# Altium schematic sheet CamLink.SchDoc
size B; SheetNumber: 1; SheetTotal: 4
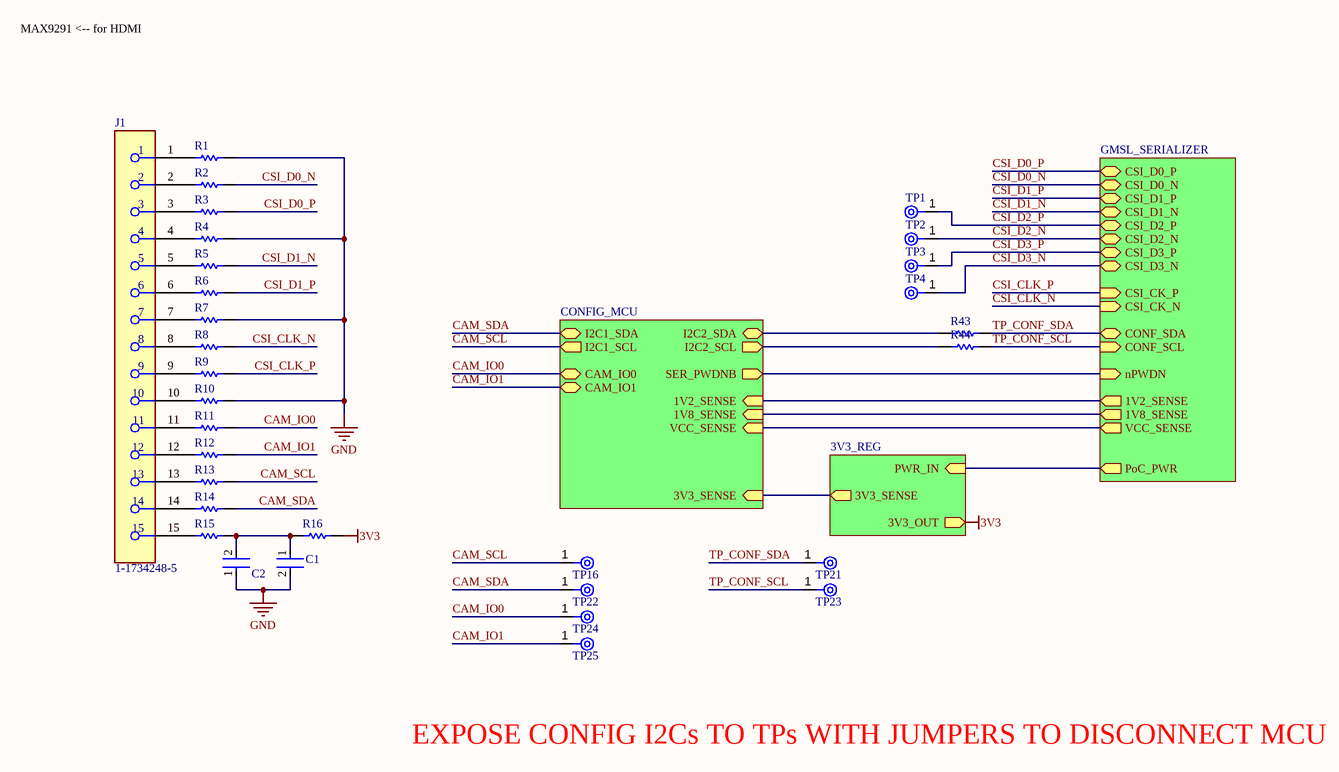
[diagram p0: CamLink.SchDoc]

## Parts
C1  CL05A106MP5NUNC  [FP-CL05A106MP5NUNC-MFG]  (value not drawn)
C2  C1005X7R1H104K050BB  [FP-C1005-050-0_05-IPC_C]  (value not drawn)
J1  1-1734248-5  [FP-1-1734248-5-MFG]
R1  RC0402JR-070RL  [RESC1005X40X25NL05T10]  (value not drawn)
R2  RC0402JR-070RL  [RESC1005X40X25NL05T10]  (value not drawn)
R3  RC0402JR-070RL  [RESC1005X40X25NL05T10]  (value not drawn)
R4  RC0402JR-070RL  [RESC1005X40X25NL05T10]  (value not drawn)
R5  RC0402JR-070RL  [RESC1005X40X25NL05T10]  (value not drawn)
R6  RC0402JR-070RL  [RESC1005X40X25NL05T10]  (value not drawn)
R7  RC0402JR-070RL  [RESC1005X40X25NL05T10]  (value not drawn)
R8  RC0402JR-070RL  [RESC1005X40X25NL05T10]  (value not drawn)
R9  RC0402JR-070RL  [RESC1005X40X25NL05T10]  (value not drawn)
R10  RC0402JR-070RL  [RESC1005X40X25NL05T10]  (value not drawn)
R11  RC0402JR-070RL  [RESC1005X40X25NL05T10]  (value not drawn)
R12  RC0402JR-070RL  [RESC1005X40X25NL05T10]  (value not drawn)
R13  RC0402JR-070RL  [RESC1005X40X25NL05T10]  (value not drawn)
R14  RC0402JR-070RL  [RESC1005X40X25NL05T10]  (value not drawn)
R15  RC0402JR-070RL  [RESC1005X40X25NL05T10]  (value not drawn)
R16  RC0402JR-070RL  [RESC1005X40X25NL05T10]  (value not drawn)
R43  RC0402JR-070RL  [RESC1005X40X25NL05T10]  (value not drawn)
R44  RC0402JR-070RL  [RESC1005X40X25NL05T10]  (value not drawn)
TP1  TPAD6R  [New footprint 1]  (value not drawn)
TP2  TPAD6R  [New footprint 1]  (value not drawn)
TP3  TPAD6R  [New footprint 1]  (value not drawn)
TP4  TPAD6R  [New footprint 1]  (value not drawn)
TP16  TPAD6R  [New footprint 1]  (value not drawn)
TP21  TPAD6R  [New footprint 1]  (value not drawn)
TP22  TPAD6R  [New footprint 1]  (value not drawn)
TP23  TPAD6R  [New footprint 1]  (value not drawn)
TP24  TPAD6R  [New footprint 1]  (value not drawn)
TP25  TPAD6R  [New footprint 1]  (value not drawn)

## Sub-sheets
ADJ_REG = 3V3_REG: PWR_IN (in), 3V3_OUT (out), 3V3_SENSE (out)
CAM_IF = GMSL_SERIALIZER: CSI_D0_P (bidir), CSI_D0_N (bidir), CSI_D1_P (bidir), CSI_D1_N (bidir), CSI_D2_P (bidir), CSI_D2_N (bidir), CSI_D3_P (bidir), CSI_D3_N (bidir), CSI_CK_P (in), CSI_CK_N (in), CONF_SDA (bidir), CONF_SCL (in), nPWDN (in), PoC_PWR (out), 1V2_SENSE (out), 1V8_SENSE (out), VCC_SENSE (out)
CONFIG_MCU = CONFIG_MCU: I2C2_SDA (bidir), I2C2_SCL (out), I2C1_SDA (bidir), I2C1_SCL (out), CAM_IO0 (bidir), CAM_IO1 (bidir), SER_PWDNB (out), 3V3_SENSE (in), 1V8_SENSE (in), 1V2_SENSE (in), VCC_SENSE (in)

## Nets
3V3: R16.2 ; sheet ADJ_REG/3V3_OUT
GND: C1.2 C2.1 R1.2 R4.2 R7.2 R10.2
CAM_IO0: R11.2 TP24.1(TP) ; sheet CONFIG_MCU/CAM_IO0
CAM_IO1: R12.2 TP25.1(TP) ; sheet CONFIG_MCU/CAM_IO1
CAM_SCL: R13.2 TP16.1(TP) ; sheet CONFIG_MCU/I2C1_SCL
CAM_SDA: R14.2 TP22.1(TP) ; sheet CONFIG_MCU/I2C1_SDA
CSI_CLK_N: R8.2 ; sheet CAM_IF/CSI_CK_N
CSI_CLK_P: R9.2 ; sheet CAM_IF/CSI_CK_P
CSI_D0_N: R2.2 ; sheet CAM_IF/CSI_D0_N
CSI_D0_P: R3.2 ; sheet CAM_IF/CSI_D0_P
CSI_D1_N: R5.2 ; sheet CAM_IF/CSI_D1_N
CSI_D1_P: R6.2 ; sheet CAM_IF/CSI_D1_P
CSI_D2_N: TP2.1(TP) ; sheet CAM_IF/CSI_D2_N
CSI_D2_P: TP1.1(TP) ; sheet CAM_IF/CSI_D2_P
CSI_D3_N: TP4.1(TP) ; sheet CAM_IF/CSI_D3_N
CSI_D3_P: TP3.1(TP) ; sheet CAM_IF/CSI_D3_P
TP_CONF_SCL: R44.2 TP23.1(TP) ; sheet CAM_IF/CONF_SCL
TP_CONF_SDA: R43.2 TP21.1(TP) ; sheet CAM_IF/CONF_SDA
NetC1_1: C1.1 C2.2 R15.2 R16.1
NetJ1_1: J1.1 R1.1
NetJ1_2: J1.2 R2.1
NetJ1_3: J1.3 R3.1
NetJ1_4: J1.4 R4.1
NetJ1_5: J1.5 R5.1
NetJ1_6: J1.6 R6.1
NetJ1_7: J1.7 R7.1
NetJ1_8: J1.8 R8.1
NetJ1_9: J1.9 R9.1
NetJ1_10: J1.10 R10.1
NetJ1_11: J1.11 R11.1
NetJ1_12: J1.12 R12.1
NetJ1_13: J1.13 R13.1
NetJ1_14: J1.14 R14.1
NetJ1_15: J1.15 R15.1
NetR43_1: R43.1 ; sheet CONFIG_MCU/I2C2_SDA
NetR44_1: R44.1 ; sheet CONFIG_MCU/I2C2_SCL
(unnamed): sheet CAM_IF/nPWDN, sheet CONFIG_MCU/SER_PWDNB
(unnamed): sheet CAM_IF/PoC_PWR, sheet ADJ_REG/PWR_IN
(unnamed): sheet CAM_IF/1V2_SENSE, sheet CONFIG_MCU/1V2_SENSE
(unnamed): sheet CAM_IF/1V8_SENSE, sheet CONFIG_MCU/1V8_SENSE
(unnamed): sheet CAM_IF/VCC_SENSE, sheet CONFIG_MCU/VCC_SENSE
(unnamed): sheet ADJ_REG/3V3_SENSE, sheet CONFIG_MCU/3V3_SENSE

## Notes on the sheet
- MAX9291 <-- for HDMI
- EXPOSE CONFIG I2Cs TO TPs WITH JUMPERS TO DISCONNECT MCU

## Library data of the parts
C1 = CMP-13271-000002-1: CAP CER 10UF 10V X5R 0402; Manufacturer: Samsung; Temperature Coefficient: 15%; Tolerance: 20%; Material: Ceramic; Octopart: https://octopart.com/cl05a106mp5nunc-samsung-22457395; Voltage Rating: 10V; RoHS: TRUE; Value: 10uF; Height: 0.7mm; Digikey Description: CAP CER 10UF 10V X5R 0402; Automotive: No; Package: CL05A106MP5NUNC; Device Class L1: Passive Components; Capacitance: 10uF; Temperature Range High: +85°C; ComponentLink2Description: Datasheet; Device Class L2: Capacitors; Temperature Characteristic: X5R; Manufacturer Part Number: CL05A106MP5NUNC; Temperature: -55°C to +85°C; ComponentLink2URL: http://www.samsungsem.com/kr/support/product-search/mlcc/__icsFiles/afieldfile/2019/05/10/19-CL05A106MP5NUNC.pdf; Device Class L3: Ceramic Capacitors; Category: Cap; Temperature Range Low: -55°C; Ipc Land Pattern Name: CAPC10050X50; Lead Free: Yes
C2 = CMP-2000-05393-2: Multilayer Ceramic Capacitors 100nF ±10% 50V X7R SMD 0402; Voltage: 50V; Dielectric Material: Ceramic; Min Operating Temperature: -55°C; Depth: 0.5mm; Radiation Hardening: No; RoHS Compliant: Yes; Voltage Rating (DC): 50V; Lead Free: Lead Free; Resistor Type: Ceramic; Height: 0.5mm; Dielectric: X7R; Thickness: 0.022inch; Case/Package: 0402; Case Code (Metric): 1005; Termination: SMD/SMT; Capacitance: 100nF; Packaging: Tape and Reel; Max Operating Temperature: 125°C; Mount: Surface Mount; Package Quantity: 1; Width: 0.02inch; Weight: 2.3E-05oz; Voltage Rating: 50V; Tolerance: 10%; Construction: Flat; Case Code (Imperial): 0402; Length: 1mm; REACH SVHC: No SVHC; Series: C
J1 = CMP-03368-000001-1: CONN FPC VERT 15POS 1.00MM SMD; Manufacturer: TE; Conn Orientation: Vertical; Conn Gender: Female; Current Rating: 1A; Is Female: yes; Number Of Contacts: 15; Pitch: 1mm; Voltage Rating: 125V; ComponentLink2URL: https://www.te.com/commerce/DocumentDelivery/DDEController?Action=showdoc&DocId=Customer+Drawing%7F1734248%7FE1%7Fpdf%7FEnglish%7FENG_CD_1734248_E1__.pdf%7F1-1734248-5; Device Class L1: Connectors; Category: Conn; Package: 0; Lead Free: Yes; Digikey Description: CONN FPC VERT 15POS 1.00MM SMD; Height: 8mm; Manufacturer Part Number: 1-1734248-5; Temperature: -20°C to +85°C; Contact Material: Gold,Nickel; Device Class L3: unset; ComponentLink2Description: Datasheet; RoHS: TRUE; Temperature Range Low: -20°C; Octopart: https://octopart.com/1-1734248-5-te+connectivity-40620898; Device Class L2: FFC / FPC; Mouser Description: FFC & FPC Connectors 15P 1.0 FPC, Zip V/T SMT; Automotive: No; Temperature Range High: +85°C; Mounting Type: Surface Mount
R1-R16 R43 R44 = CMP-1011-00001-2: Manufacturer: Yageo / Phycomp; Part Number: RC0402JR-070RL
TP1-TP4 TP16 TP21-TP25 = CMP-00025-2: Test Point .6mm